# EAGLE design KranControlV1_2 (EAGLE 6.5.0)
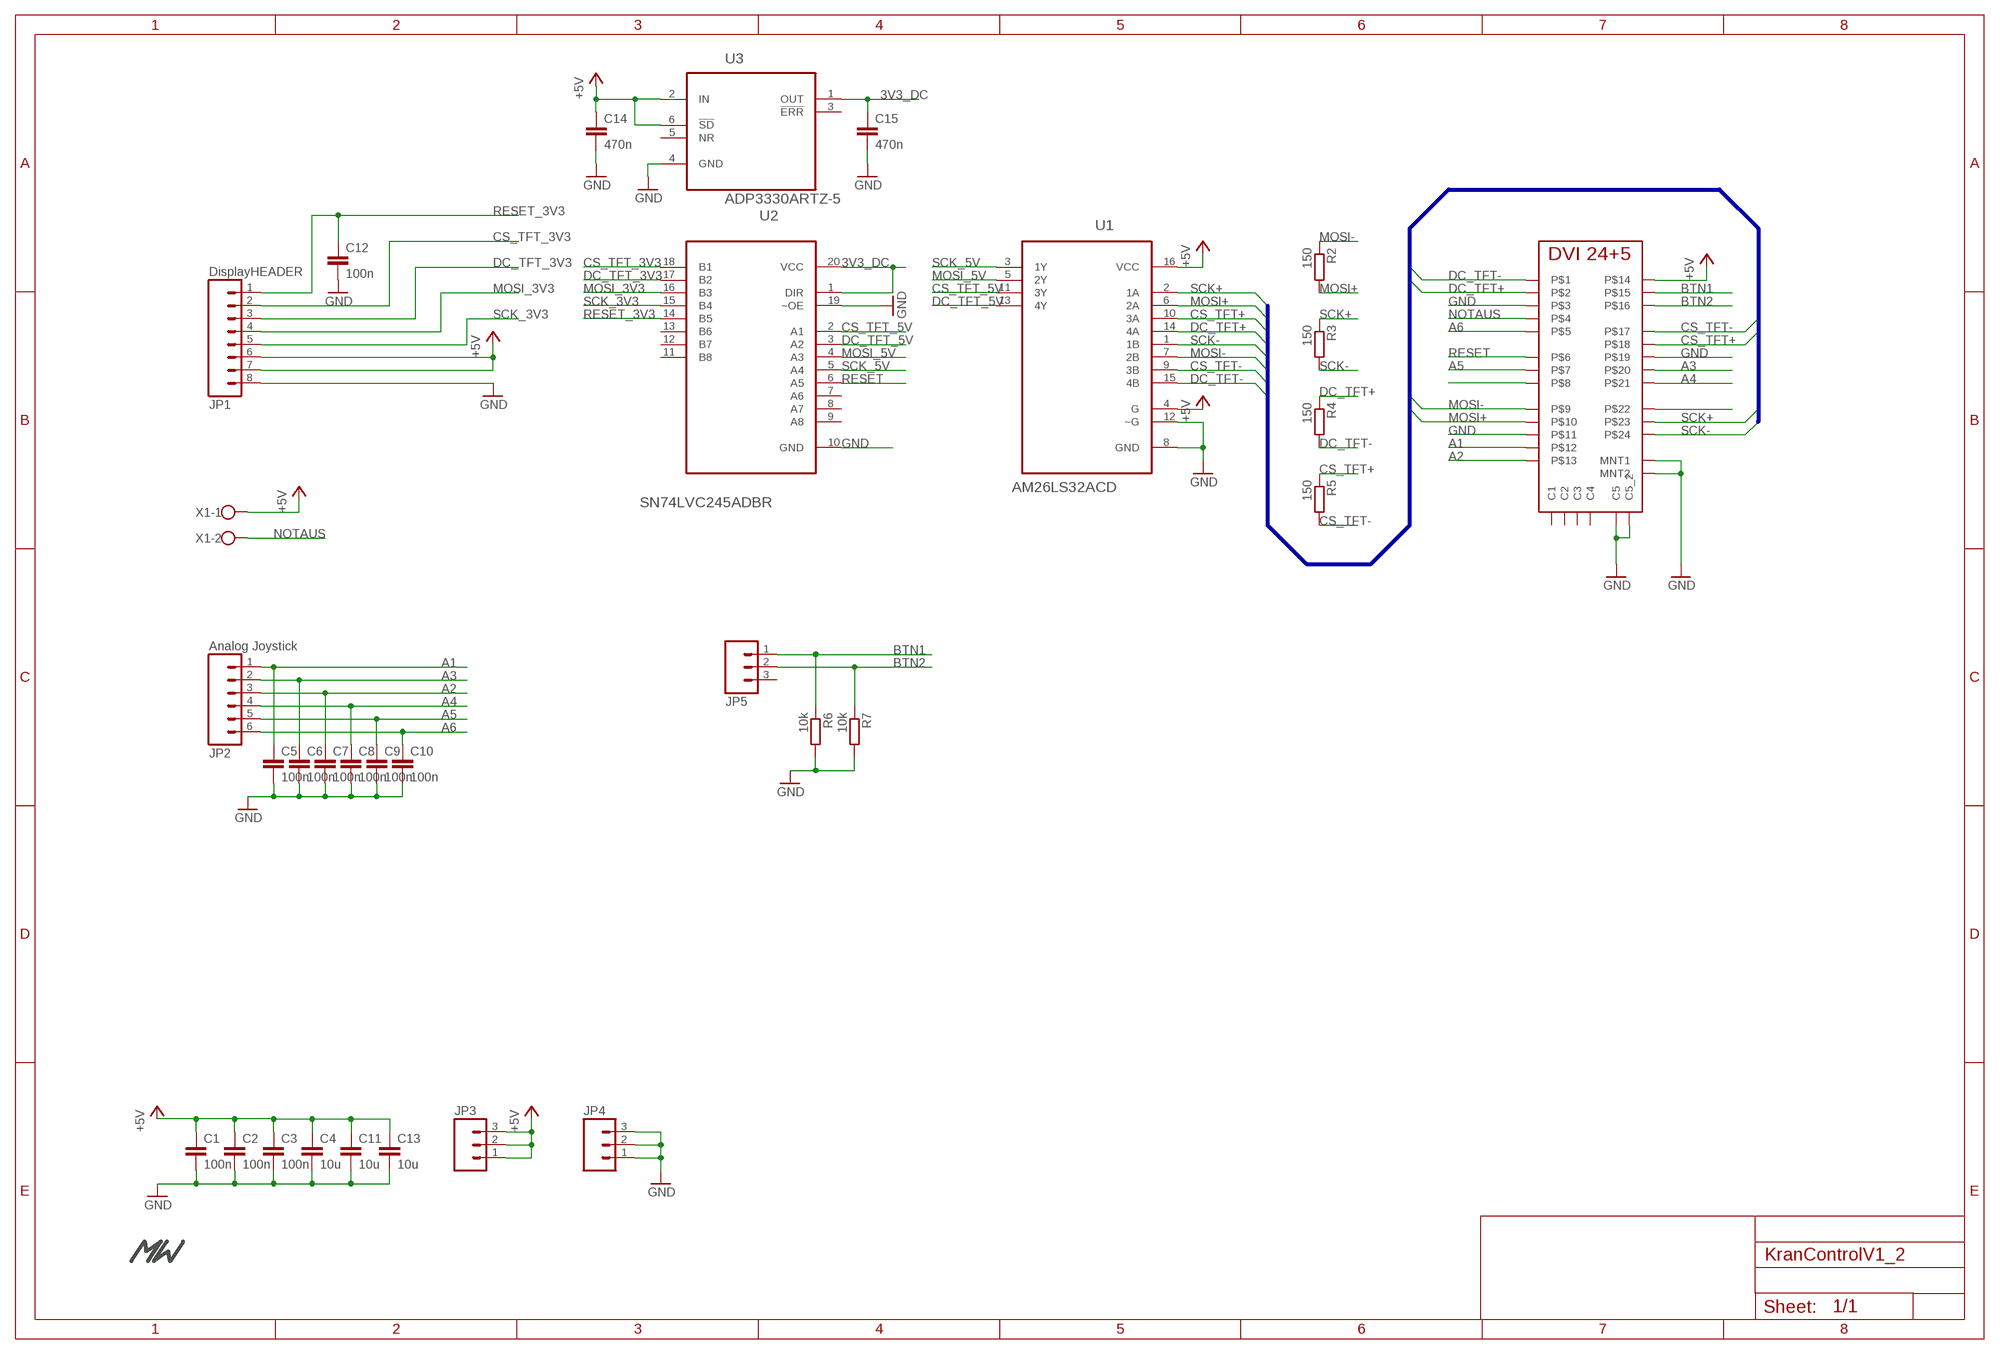
[diagram p0: schematic, sheet 1]

## Parts
C1  100n  C-EUC0603  [C0603]
C2  100n  C-EUC0603  [C0603]
C3  100n  C-EUC0603  [C0603]
C4  10u  C-EUC1206  [C1206]
C5  100n  C-EUC0603  [C0603]
C6  100n  C-EUC0603  [C0603]
C7  100n  C-EUC0603  [C0603]
C8  100n  C-EUC0603  [C0603]
C9  100n  C-EUC0603  [C0603]
C10  100n  C-EUC0603  [C0603]
C11  10u  C-EUC1206  [C1206]
C12  100n  C-EUC0603  [C0603]
C13  10u  C-EUC1206  [C1206]
C14  470n  C-EUC0603  [C0603]
C15  470n  C-EUC0603  [C0603]
JP1  DisplayHEADER  M08LOCK  [1X08_LOCK]
JP2  Analog Joystick  M06FEMALE_LOCK  [1X06_FEMALE_LOCK.010]
JP3  M03LOCK  [1X03_LOCK]
JP4  M03LOCK  [1X03_LOCK]
JP5  M03LOCK  [1X03_LOCK]
R2  150  R-EU_R0603  [R0603]
R3  150  R-EU_R0603  [R0603]
R4  150  R-EU_R0603  [R0603]
R5  150  R-EU_R0603  [R0603]
R6  10k  R-EU_R0603  [R0603]
R7  10k  R-EU_R0603  [R0603]
U1  AM26LS32ACD  [SOIC127P600X175-16N]
U2  SN74LVC245ADBR  [SOP65P780X200-20N]
U3  ADP3330ARTZ-5  [SOT95P280X145-6N]
U$1  DVI_BUCHSE  [DVI_BUCHSE]
U$3  MW_LOGO  [MW_11X5MM]
X1  W237-102  [W237-102]

## Nets
3V3_DC: C15.1 U2.1(DIR) U2.20(VCC) U3.1(OUT)
+5V: C1.1 C2.1 C3.1 C4.1 C11.1 C13.1 C14.1 JP1.6 JP1.7 JP3.1 JP3.2 JP3.3 U1.4(G) U1.16(VCC) U3.2(IN) U3.6(!SD) U$1.P$14 X1.1
A1: C5.1 JP2.1 U$1.P$12
A2: C7.1 JP2.3 U$1.P$13
A3: C6.1 JP2.2 U$1.P$4
A4: C8.1 JP2.4 U$1.P$5
A5: C9.1 JP2.5 U$1.P$23
A6: C10.1 JP2.6 U$1.P$21
BTN1: JP5.1 R6.1 U$1.P$15
BTN2: JP5.2 R7.1 U$1.P$16
CS_TFT+: R5.1 U1.10(3A) U$1.P$2
CS_TFT-: R5.2 U1.9(3B) U$1.P$1
CS_TFT_3V3: JP1.2 U2.18(B1)
CS_TFT_5V: U1.11(3Y) U2.2(A1)
DC_TFT+: R4.1 U1.14(4A) U$1.P$18
DC_TFT-: R4.2 U1.15(4B) U$1.P$17
DC_TFT_3V3: JP1.3 U2.17(B2)
DC_TFT_5V: U1.13(4Y) U2.3(A2)
GND: C1.2 C2.2 C3.2 C4.2 C5.2 C6.2 C7.2 C8.2 C9.2 C10.2 C11.2 C12.2 C13.2 C14.2 C15.2 JP1.8 JP4.1 JP4.2 JP4.3 R6.2 R7.2 U1.8(GND) U1.12(~G) U2.10(GND) U2.19(~OE) U3.4(GND) U$1.MNT1 U$1.MNT2 U$1.P$3 U$1.P$11 U$1.P$19 U$1.P$28(C5) U$1.P$30(C5_2)
MOSI+: R2.2 U1.6(2A) U$1.P$10
MOSI-: R2.1 U1.7(2B) U$1.P$9
MOSI_3V3: JP1.4 U2.16(B3)
MOSI_5V: U1.5(2Y) U2.4(A3)
N$2: U$1.P$24
N$4: U$1.P$6
NOTAUS: U$1.P$20 X1.2
RESET: U2.6(A5) U$1.P$22
RESET_3V3: C12.1 JP1.1 U2.14(B5)
SCK+: R3.1 U1.2(1A) U$1.P$7
SCK-: R3.2 U1.1(1B) U$1.P$8
SCK_3V3: JP1.5 U2.15(B4)
SCK_5V: U1.3(1Y) U2.5(A4)
Unconnected: JP5.3 U2.7(A6) U2.8(A7) U2.9(A8) U2.11(B8) U2.12(B7) U2.13(B6) U3.3(!ERR) U3.5(NR) U$1.P$25(C2) U$1.P$26(C4) U$1.P$27(C3) U$1.P$29(C1)

## Buses
MISO+,MISO-,DC_TFT+,DC_TFT-,MOSI+,MOSI-,CS_TFT+,CS_TFT-,SCK+,SCK-

## Library data of the parts
C1-C15 = rcl:C-EU: CAPACITOR, European symbol
JP1 = SparkFun:M08: Header 8 Standard 8-pin 0.1" header. Use with straight break away headers (SKU : PRT-00116), right angle break away headers (PRT-00553), swiss pins (PRT-00743), machine pins (PRT-00117), and female headers (PRT-00115).
JP2 = SparkFun:M06: Header 6 Standard 6-pin 0.1" header. Use with straight break away headers (SKU : PRT-00116), right angle break away headers (PRT-00553), swiss pins (PRT-00743), machine pins (PRT-00117), and female headers (PRT-00115). Molex polarized connector foot print use with SKU : PRT-08094 with associated crimp pins and housings. NOTES ON THE VARIANTS LOCK and LOCK_LONGPADS... This footprint was designed to help hold the alignment of a through-hole component (i.e. 6-pin header) while soldering it into place. You may notice that each hole has been shifted either up or down by 0.005 of an inch from it's more standard position (which is a perfectly straight line). This slight alteration caused the pins (the squares in the middle) to touch the edges of the holes. Because they are alternating, it causes a "brace" to hold the component in place. 0.005 has proven to be the perfect amount of "off-center" position when using our standard breakaway headers. Although looks a little odd when you look at the bare footprint, once you have a header in there, the alteration is very hard to notice. Also, if you push a header all the way into place, it is covered up entirely on the bottom side. This idea of altering the position of holes to aid alignment will be further integrated into the Sparkfun Library for other footprints. It can help hold any component with 3 or more connection pins.
JP3-JP5 = SparkFun:M03: Header 3 Standard 3-pin 0.1" header. Use with straight break away headers (SKU : PRT-00116), right angle break away headers (PRT-00553), swiss pins (PRT-00743), machine pins (PRT-00117), and female headers (PRT-00115). Molex polarized connector foot print use with SKU : PRT-08232 with associated crimp pins and housings.
R2-R7 = rcl:R-EU_: RESISTOR, European symbol
U1 = Matthias:AM26LS32ACD: QUADRUPLE RS-485 DIFFERENTIAL LINE RECEIVERS; MPN: AM26LS32ACD; OC_FARNELL: 1103045; OC_NEWARK: 06F1118; PACKAGE: SOIC-16; SUPPLIER: TEXAS INSTRUMENTS
U2 = SN74LVC245A:SN74LVC245ADBR: OCTAL BUS TRANSCEIVER WITH 3-STATE OUTPUTS; MPN: SN74LVC245ADBR; OC_FARNELL: 1595415; OC_NEWARK: 94T5061; PACKAGE: TSSOP-20; SUPPLIER: TEXAS INSTRUMENTS
U3 = ADP3330:ADP3330ARTZ-5: LDO, 2.9-12V, 0.14VD, 0.2A, 5V, SOT-23-6; MPN: ADP3330ARTZ-5; OC_FARNELL: 2305723; OC_NEWARK: 84W7355; PACKAGE: SOT-23-6; SUPPLIER: ANALOG DEVICES
U$1 = Matthias:DVI_BUCHSE
U$3 = MWlogo:MW_LOGO
X1 = con-wago-500:W237-102: WAGO SCREW CLAMP; MPN: 237-102; OC_FARNELL: unknown; OC_NEWARK: 70K9898

## Board
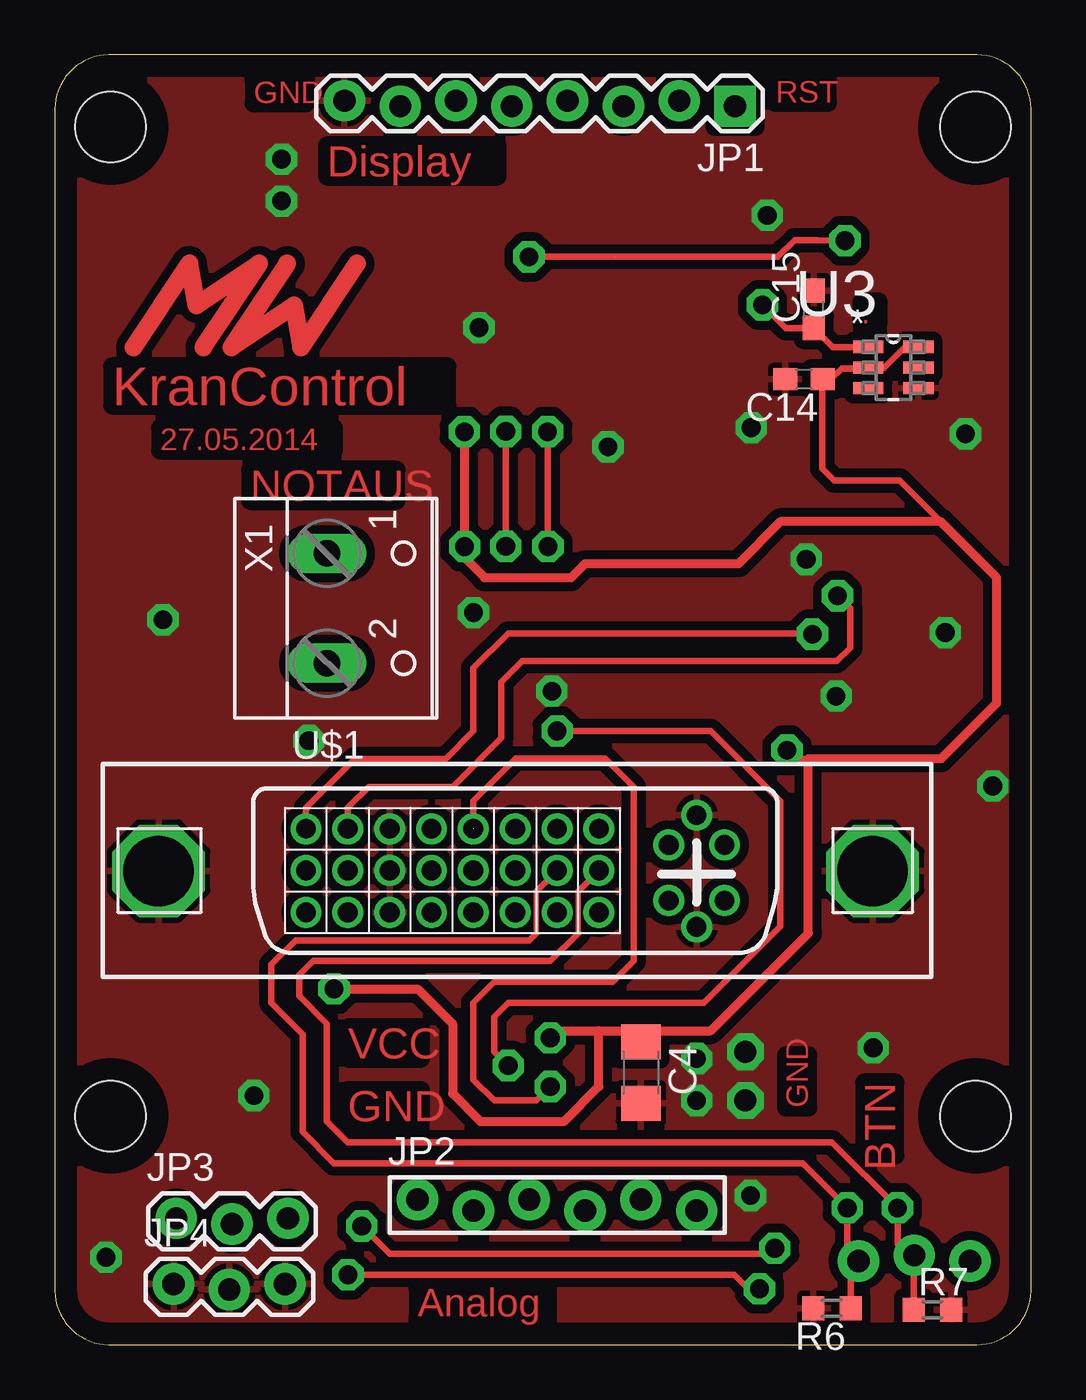
[diagram p1: board, top side]
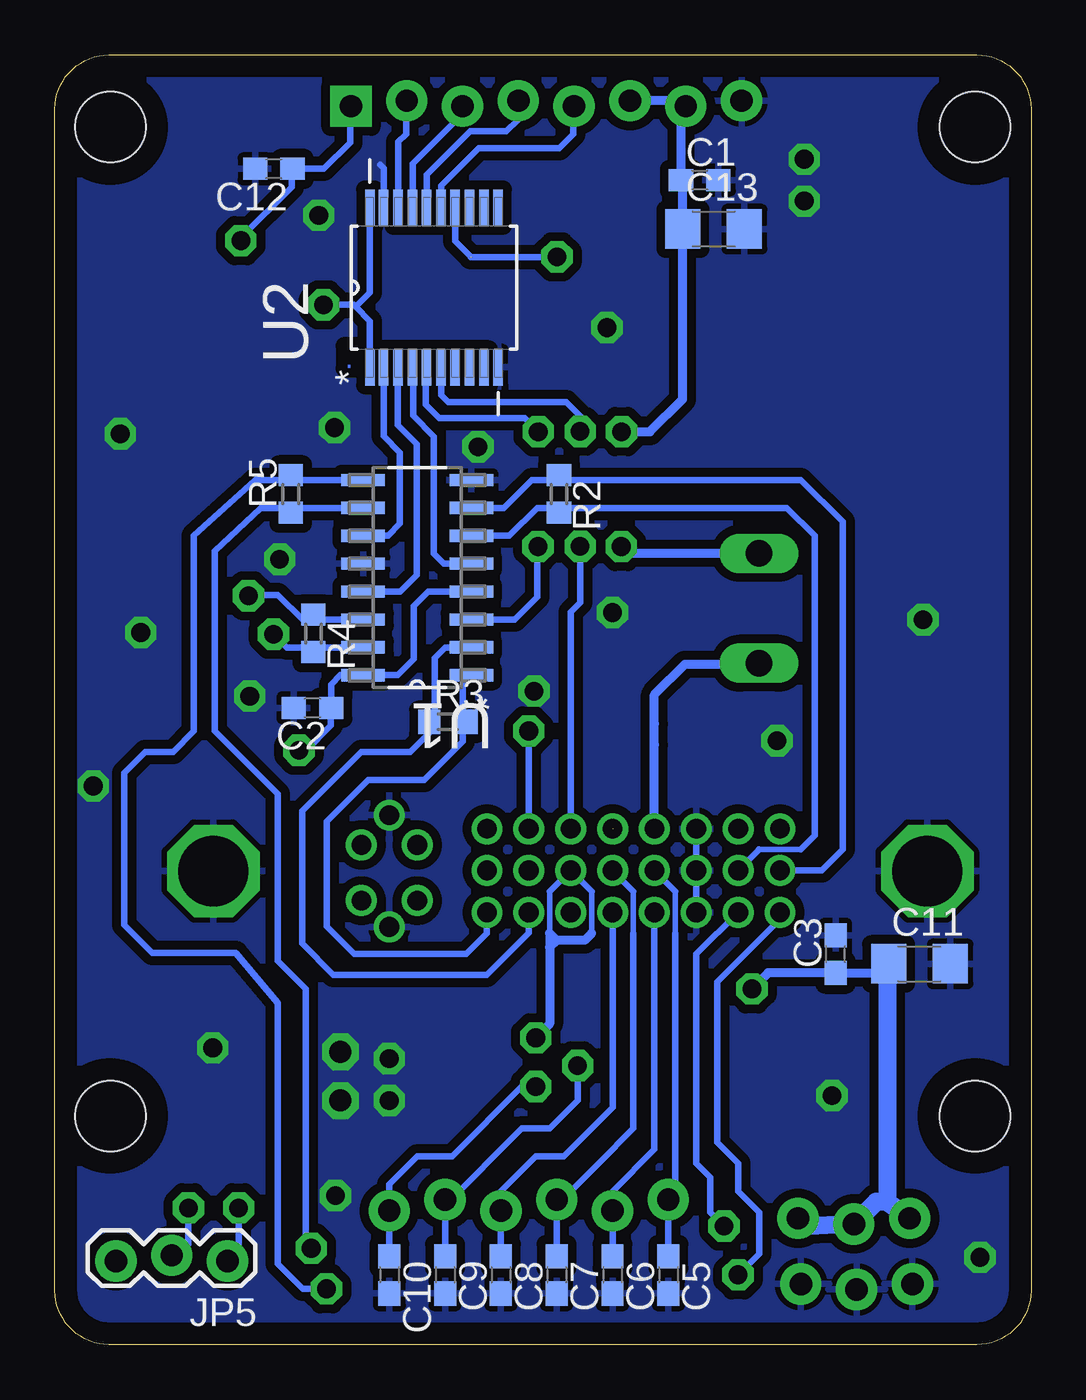
[diagram p2: board, bottom side, seen from below]

Size 44.43 x 58.73 mm. Coordinates in mm from the lower left corner, seen from the top.
Outline: 0,56.27 0,2.46 arc90 2.46,0 41.97,0 arc90 44.43,2.46 44.43,56.27 arc90 41.97,58.73 2.46,58.73 arc90 0,56.27
Copper layers (1*16): Top 0.035mm / dielectric 1.5mm / Bottom 0.035mm
Design rules "default": minimum track width 10mil, minimum drill 24mil, track to track 8mil, track to pad 8mil, pad to pad 8mil, via to via 8mil, smd to smd 8mil, copper to edge 40mil, drill to drill 8mil, minimum pad ring 10mil, minimum via ring 8mil, stop-mask expansion 4mil, vias tented up to drill 0mil, thermal gap 10mil
Holes 3.2 mm at 2.54,10.41 41.91,10.41 41.91,55.44 2.54,55.44

### Footprints (pad centres in the part's own frame; a part is rotated, then mirrored left to right if it is on the bottom)
C0603 = smd 1.1 x 1: 1 -0.85,0; 2 0.85,0
C1206 = smd 1.6 x 1.8: 1 -1.4,0; 2 1.4,0
1X08_LOCK = drill 1.016 pad 1.88 square: 1 0,0.127 | drill 1.016 pad 1.88: 2 2.54,-0.127; 3 5.08,0.127; 4 7.62,-0.127; 5 10.16,0.127; 6 12.7,-0.127; 7 15.24,0.127; 8 17.78,-0.127
1X06_FEMALE_LOCK.010 = drill 1.016 pad 1.88: 1 0,0.254; 2 2.54,-0.254; 3 5.08,0.254; 4 7.62,-0.254; 5 10.16,0.254; 6 12.7,-0.254
1X03_LOCK = drill 1.016 pad 1.88: 1 0,0.127; 2 2.54,-0.127; 3 5.08,0.127
R0603 = smd 1 x 1.1: 1 -0.85,0; 2 0.85,0
SOIC127P600X175-16N = smd 1.981 x 0.559: 1 -2.464,4.445; 2 -2.464,3.175; 3 -2.464,1.905; 4 -2.464,0.635; 5 -2.464,-0.635; 6 -2.464,-1.905; 7 -2.464,-3.175; 8 -2.464,-4.445; 9 2.464,-4.445; 10 2.464,-3.175; 11 2.464,-1.905; 12 2.464,-0.635; 13 2.464,0.635; 14 2.464,1.905; 15 2.464,3.175; 16 2.464,4.445
SOP65P780X200-20N = smd 1.651 x 0.432: 1 -3.632,2.921; 2 -3.632,2.286; 3 -3.632,1.626; 4 -3.632,0.965; 5 -3.632,0.33; 6 -3.632,-0.33; 7 -3.632,-0.965; 8 -3.632,-1.626; 9 -3.632,-2.286; 10 -3.632,-2.921; 11 3.632,-2.921; 12 3.632,-2.286; 13 3.632,-1.626; 14 3.632,-0.965; 15 3.632,-0.33; 16 3.632,0.33; 17 3.632,0.965; 18 3.632,1.626; 19 3.632,2.286; 20 3.632,2.921
SOT95P280X145-6N = smd 1.372 x 0.559: 1 -1.143,0.94; 2 -1.143,0; 3 -1.143,-0.94; 4 1.143,-0.94; 5 1.143,0; 6 1.143,0.94
DVI_BUCHSE = drill 3.2 octagon: MNT1 -6.71,1.878; MNT2 25.79,1.878 | drill 0.9: P$1 -0.003,-0.006; P$2 1.902,-0.006; P$3 3.807,-0.006; P$4 5.712,-0.006; P$5 7.617,-0.006; P$6 9.522,-0.006; P$7 11.427,-0.006; P$8 13.332,-0.006; P$9 -0.003,1.899; P$10 1.902,1.899; P$11 3.807,1.899; P$12 5.712,1.899; P$13 7.617,1.899; P$14 9.522,1.899; P$15 11.427,1.899; P$16 13.332,1.899; P$17 -0.003,3.804; P$18 1.902,3.804; P$19 3.807,3.804; P$20 5.712,3.804; P$21 7.617,3.804; P$22 9.522,3.804; P$23 11.427,3.804; P$24 13.332,3.804; P$25 19.047,3.07; P$26 19.047,0.53; P$27 16.507,0.53; P$28 17.777,-0.661; P$29 16.507,3.07; P$30 17.777,4.42
W237-102 = drill 1.194 long: 1 -2.5,-1.27; 2 2.5,-1.27

### Placement (x,y rotation side)
C1  15.08,53.02 0 bottom
C2  32.7,28.99 180 bottom
C3  8.89,17.78 90 bottom
C4  26.67,12.38 270 top
C5  16.51,3.17 270 bottom
C6  19.05,3.17 270 bottom
C7  21.59,3.17 270 bottom
C8  24.13,3.17 270 bottom
C9  26.67,3.17 270 bottom
C10  29.21,3.17 270 bottom
C11  5.08,17.34 0 bottom
C12  34.47,53.54 180 bottom
C13  14.45,50.8 0 bottom
C14  34.1,43.95 180 top
C15  34.54,47.14 90 top
JP1  30.96,56.52 180 top
JP2  16.51,6.35 0 top
JP3  5.52,5.62 0 top
JP4  5.4,2.64 0 top
JP5  36.58,3.94 180 bottom
R2  21.49,38.73 270 bottom
R3  26.54,28.36 0 bottom
R4  32.66,32.38 270 bottom
R5  33.69,38.73 90 bottom
R6  35.37,1.65 180 top
R7  39.94,1.59 0 top
U1  27.94,34.92 180 bottom
U2  27.18,48.13 90 bottom
U3  38.16,44.49 0 top
U$1  11.43,19.68 0 top
U$3  3.58,45.42 0 top
X1  13.65,33.53 270 top

### Tracks (layer width: path | path; a pad name or v marks a point on that pad's centre or on a via)
3V3_DC  (via drill 0.85 pad 1.42)
  Top 0.305: 32.23,47.37 v32.21,47.35 33.26,46.29 C15.1 35.41,45.43 U3.1
  Bottom 0.305: v32.21,47.35 30.84,47.35 30.75,47.26 | 30.75,47.26 30.1,46.61 U2.1 | U2.20 30.1,47.9 30.75,47.26
+5V  (via drill 0.85 pad 1.42)
  Top 0.305: 40.45,37.34 38.46,39.33 35.47,39.33 34.92,39.88 34.92,43.93 C14.1 35.32,43.95 35.81,44.45 36.98,44.45 U3.2 37.76,44.49 38.73,45.47 39.27,45.47 U3.6 | 34.29,26.67 33.72,26.67 v33.33,27.06
  Top 0.406: v22.54,13.97 22.86,14.29 24.77,14.29 | 24.77,14.29 26.99,14.29 | 26.99,14.29 29.84,14.29 34.29,18.73 34.29,26.67 40.32,26.67 42.86,29.21 42.86,34.92 40.45,37.34 40.32,37.47 33.02,37.47 31.11,35.56 24.13,35.56 23.5,34.92 19.56,34.92 18.67,35.81 18.67,36.32 v18.65,36.34 18.65,41.55 v18.64,41.57 | v12.7,16.19 16.51,16.19 18.1,14.61 18.1,11.43 19.37,10.16 23.18,10.16 24.77,11.75 24.77,14.29 | C4.1 26.99,14.29
  Bottom 0.254: 21.91,20.64 21.91,18.73 | 20,20.64 20,18.73
  Bottom 0.305: 21.91,20.64 U$1.P$14 20,20.64 | U1.4 27.43,34.29 28.1,33.62 28.1,31.21 28.83,30.48 U1.16 31.43,30.48 31.85,30.06 C2.1 31.86,28.98 31.86,28.19 32.99,27.06 v33.33,27.06
  Bottom 0.406: 6.8,17.55 C11.1 6.58,16.93 C3.1 11.96,16.93 v12.7,16.19 | 20,18.73 20.32,18.41 21.59,18.41 | 21.59,18.41 21.91,18.73 21.91,18.1 | 21.59,18.41 21.91,18.1 | 21.91,18.1 21.91,14.61 v22.54,13.97 | v18.64,41.57 17.35,41.57 15.88,43.04 15.88,50.77 C13.1 15.85,52.94 C1.1 15.93,56.19 | 15.93,56.19 15.91,56.19 JP1.7 | 15.93,56.19 16.38,56.64 JP1.6 | X1.1 18.34,36.03 v18.65,36.34
  Bottom 0.61: 6.54,16.77 C11.1
  Bottom 0.813: 6.54,16.77 6.54,6.51 | 6.54,6.51 JP3.1 | 6.54,6.51 7.05,6.51 JP3.2 10.48,5.37 JP3.3
A1
  Bottom 0.254: 16.19,20.64 16.19,18.73
  Bottom 0.305: U$1.P$12 16.19,20.64 | 16.19,18.73 16.19,6.29 JP2.1 C5.1
A2
  Bottom 0.254: 18.1,20.64 18.1,18.73
  Bottom 0.305: U$1.P$13 18.1,20.64 | 18.1,18.73 18.1,9.84 19.68,8.26 20.32,7.62 21.59,6.35 JP2.3 C7.1
A3
  Bottom 0.305: U$1.P$4 17.14,8.89 19.05,6.99 JP2.2 C6.1
A4
  Bottom 0.305: U$1.P$5 19.05,10.8 21.27,8.57 22.54,8.57 24.13,6.99 JP2.4 C8.1
A5  (via drill 0.85 pad 1.42)
  Top 0.305: v20.64,12.7 20,13.34 20,14.92 20.64,15.56 29.53,15.56 33.02,19.05 33.02,24.77 29.84,27.94 v22.86,27.94
  Bottom 0.305: C9.1 JP2.5 26.67,6.35 23.18,9.84 21.91,9.84 20.64,11.11 v20.64,12.7 | U$1.P$23 v22.86,27.94
A6  (via drill 0.85 pad 1.42)  (1 unrouted)
  Top 0.305: v22.54,11.75 21.91,11.11 20,11.11 19.05,12.06 19.05,15.56 20,16.51 25.4,16.51 26.35,17.46 26.35,25.39 25.04,26.7 20.97,26.7 19.04,24.77 19.04,23.5
  Bottom 0.305: C10.1 JP2.6 29.21,7.3 27.94,8.57 26.35,8.57 23.18,11.75 v22.54,11.75
BTN1  (via drill 0.85 pad 1.42)
  Top 0.254: 21.91,20.64 21.91,18.73
  Top 0.305: U$1.P$15 21.91,20.64 | 21.91,18.73 21.59,18.41 10.95,18.41 9.84,17.3 9.84,15.56 11.27,14.13 11.27,9.68 12.7,8.26 34.04,8.26 v36.07,6.22 36.07,4.06 JP5.1 36.22,3.71 R6.1
  Bottom 0.305: v36.07,6.22 36.07,4.06 JP5.1
BTN2  (via drill 0.85 pad 1.42)
  Top 0.254: 23.81,20.64 23.81,18.73
  Top 0.305: U$1.P$16 23.81,20.64 | 23.81,18.73 22.54,17.46 11.75,17.46 11.11,16.83 11.11,15.88 12.38,14.61 12.38,10.16 13.34,9.21 35.37,9.21 v38.35,6.22 | 38.35,6.1 38.35,4.57 JP5.2 39.09,3.83 R7.1
  Bottom 0.305: v38.35,6.22 38.35,4.57 JP5.2
CS_TFT+  (via drill 0.85 pad 1.42)
  Top 0.305: v13.97,5.4 15.24,4.13 32.51,4.13 v32.77,4.38
  Bottom 0.305: U1.10 33.74,38.1 35.05,38.1 37.15,36.13 37.15,27.94 34.29,25.08 34.29,17.46 33.02,16.19 33.02,4.64 v32.77,4.38 | U$1.P$2 15.24,17.78 15.24,8.26 14.6,7.62 14.6,6.03 v13.97,5.4
  Bottom 0.406: R5.1 33.69,38.05 33.74,38.1
CS_TFT-  (via drill 0.85 pad 1.42)
  Top 0.305: v13.34,3.17 30.92,3.17 31.56,2.54 v32.07,2.54
  Bottom 0.305: U1.9 33.78,39.37 35.31,39.37 38.1,36.83 38.1,27.94 39.05,26.99 40.32,26.99 41.27,26.04 41.27,19.11 40.01,17.84 36.2,17.84 34.29,15.56 34.29,3.68 33.15,2.54 v32.07,2.54 | U$1.P$1 11.43,19.37 14.29,16.51 14.29,9.21 13.34,8.26 13.34,6.99 12.38,6.03 12.38,4.13 v13.34,3.17
  Bottom 0.406: R5.2 33.69,39.46 33.78,39.37
CS_TFT_3V3
  Bottom 0.305: U2.18 28.8,54.76 28.45,55.12 28.45,56.61 JP1.2
CS_TFT_5V
  Bottom 0.305: U1.11 29.26,36.83 28.74,37.38 28.74,40.63 29.46,41.36 U2.2 29.45,44.49
DC_TFT+  (via drill 0.85 pad 1.42)
  Top 0.305: U$1.P$18 13.34,24.45 14.29,25.4 18.1,25.4 20.32,27.62 20.32,30.16 21.27,31.11 35.6,31.11 36.2,31.71 36.2,33.53 v35.62,34.1
  Bottom 0.305: U1.14 32.7,33.02 33.16,33.02 34.28,34.14 35.59,34.14 v35.62,34.1
  Bottom 0.406: R4.1 32.66,33.06 32.7,33.02
DC_TFT-  (via drill 0.85 pad 1.42)
  Top 0.305: U$1.P$17 11.43,24.13 11.43,24.45 13.65,26.67 17.78,26.67 19.05,27.94 19.05,30.8 20.64,32.38 34.44,32.38 v34.48,32.35
  Bottom 0.305: U1.15 32.66,31.75 33.88,31.75 v34.48,32.35
  Bottom 0.406: R4.2 32.66,31.75
DC_TFT_3V3
  Bottom 0.305: U2.17 28.14,53.77 26.04,55.88 26.04,56.23 JP1.3
DC_TFT_5V
  Bottom 0.305: U1.13 28.71,34.29 27.95,35.05 27.95,41 28.82,41.86 28.82,44.49 U2.3
GND  (via drill 0.85 pad 1.42, 1 pad 1.68)
  Bottom 0.305: U2.19 29.46,53.57 29.62,53.72 | U$1.P$3 U$1.P$11 U$1.P$19
  other vias: 29.21,13.02 29.21,11.11 35.56,29.53 10.32,53.98 10.32,52.07 19.05,33.34 40.53,32.42 37.25,13.51 2.32,3.98 31.43,13.34 31.43,11.11 32.42,51.42 34.2,35.76 25.17,40.88 4.91,33.01 31.7,41.76 19.3,46.3 41.45,41.47 11.56,27.5 42.68,25.44 22.62,29.76 9.06,11.34 31.66,6.78
  pour Bottom (isolate 0.406): 0,56.28 0,2.46 arc90 2.46,0 41.99,0 arc90 44.45,2.46 44.45,56.28 arc90 41.99,58.74 2.46,58.74 arc90
  pour Top (isolate 0.406): 0,56.28 0,2.46 arc90 2.46,0 41.99,0 arc90 44.45,2.46 44.45,56.28 arc90 41.99,58.74 2.46,58.74 arc90
MOSI+
  Bottom 0.254: 10.48,22.54 12.38,22.54
  Bottom 0.305: 10.48,22.54 9.84,23.18 9.84,36.83 11.11,38.1 21.59,38.1 22.48,38.1 23.75,36.83 U1.6 | 12.38,22.54 12.38,22.53 U$1.P$10
  Bottom 0.406: R2.2 21.49,38 21.59,38.1
MOSI-
  Bottom 0.305: U$1.P$9 9.53,21.59 8.57,22.54 8.57,37.47 10.48,39.37 21.43,39.37 22.73,39.37 24,38.1 U1.7
  Bottom 0.406: R2.1 21.49,39.43 21.43,39.37
MOSI_3V3
  Bottom 0.305: U2.16 27.51,53.26 25.53,55.24 23.88,55.24 23.37,55.75 23.37,56.61 JP1.4
MOSI_5V
  Bottom 0.305: U2.4 arc-45 28.18,44.41 28.18,43.84 28.13,43.79 28.13,42.29 27.19,41.35 27.19,36.02 26.73,35.56 U1.5
NOTAUS
  Bottom 0.406: U$1.P$20 17.14,28.26 | 17.14,27.3 17.14,28.26 | 17.14,28.26 17.14,29.59 15.75,30.99 12.42,30.99 X1.2
RESET  (via drill 0.85 pad 1.42)
  Top 0.305: v20.52,36.35 v20.52,41.58
  Bottom 0.305: U$1.P$22 20.95,33.35 20.51,33.8 20.51,36.34 v20.52,36.35 | 26.89,44.46 U2.6 26.85,43.24 26.52,42.91 21.16,42.91 20.52,42.28 v20.52,41.58
RESET_3V3  (via drill 0.85 pad 1.42)  (1 unrouted)
  Top 0.305: v21.58,49.53 32.91,49.53 33.67,50.29 34.67,50.29 v35.97,50.27
  Bottom 0.305: U2.14 26.21,50.24 25.48,49.51 | 25.5,49.52 21.59,49.52 v21.58,49.53 | v35.97,50.27 35.97,50.39 33.66,52.7 33.66,53.5 C12.1 32.19,53.54 30.99,54.74 30.99,56.36 JP1.1
SCK+
  Bottom 0.305: U1.2 26.67,31.75 27.15,31.27 27.15,28.33 27.15,28.1 28.26,26.99 30.48,26.99 33.18,24.29 33.18,18.26 31.75,16.83 24.77,16.83 22.86,18.73 U$1.P$7
  Bottom 0.406: R3.1 27.17,28.36 27.15,28.33
SCK-
  Bottom 0.305: U$1.P$8 24.77,18.73 25.72,17.78 30.8,17.78 32.07,19.05 32.07,23.81 30.16,25.72 27.62,25.72 25.88,27.46 25.88,28.28 25.88,30.08 U1.1
  Bottom 0.406: R3.2 25.8,28.36 25.88,28.28
SCK_3V3
  Bottom 0.305: U2.15 26.85,52.78 25.15,54.48 21.46,54.48 20.83,55.12 20.83,56.36 JP1.5
SCK_5V  (via drill 0.85 pad 1.42)
  Top 0.305: v22.44,36.34 22.44,41.55 v22.43,41.57
  Bottom 0.305: 27.52,44.49 U2.5 27.55,44.46 27.55,42.8 26.94,42.19 23.05,42.19 v22.43,41.57 | U1.3 23.5,33.02 22.48,34.04 22.48,36.3 v22.44,36.34

### Text on the board
Top: GND | RST | Display | . | KranControl | 27.05.2014 | NOTAUS | VCC | BTN | GND | GND | Analog
Bottom: .